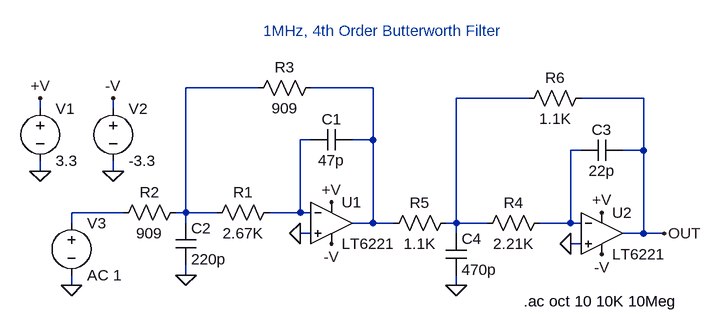
[diagram p0: schematic 6221.asc]
6221.asc, the LTspice schematic file:
Version 4
SHEET 1 1004 692
WIRE 144 48 32 48
WIRE 320 48 224 48
WIRE 560 64 448 64
WIRE 736 64 640 64
WIRE -192 80 -192 64
WIRE -80 80 -80 64
WIRE 224 128 208 128
WIRE 320 128 320 48
WIRE 320 128 288 128
WIRE 640 144 624 144
WIRE 736 144 736 64
WIRE 736 144 704 144
WIRE -192 176 -192 160
WIRE -80 176 -80 160
WIRE -64 240 -144 240
WIRE 32 240 32 48
WIRE 32 240 16 240
WIRE 80 240 32 240
WIRE 208 240 208 128
WIRE 208 240 160 240
WIRE 224 240 208 240
WIRE -144 256 -144 240
WIRE 32 256 32 240
WIRE 320 256 320 128
WIRE 320 256 288 256
WIRE 352 256 320 256
WIRE 448 256 448 64
WIRE 448 256 432 256
WIRE 496 256 448 256
WIRE 624 256 624 144
WIRE 624 256 576 256
WIRE 640 256 624 256
WIRE 224 272 208 272
WIRE 448 272 448 256
WIRE 736 272 736 144
WIRE 736 272 704 272
WIRE 768 272 736 272
WIRE 640 288 624 288
WIRE 32 336 32 320
WIRE -144 352 -144 336
WIRE 448 352 448 336
FLAG -192 176 0
FLAG 768 272 OUT
FLAG 256 224 +V
FLAG 256 288 -V
FLAG -192 64 +V
FLAG -80 176 0
FLAG -80 64 -V
FLAG 208 272 0
FLAG 32 336 0
FLAG -144 352 0
FLAG 672 240 +V
FLAG 672 304 -V
FLAG 624 288 0
FLAG 448 352 0
SYMBOL voltage -192 64 R0
WINDOW 123 44 91 Left 2
WINDOW 39 0 0 Left 2
SYMATTR InstName V1
SYMATTR Value 3.3
SYMBOL voltage -80 64 R0
WINDOW 123 44 91 Left 2
WINDOW 39 0 0 Left 2
SYMATTR InstName V2
SYMATTR Value -3.3
SYMBOL cap 288 112 R90
WINDOW 0 0 32 VBottom 2
WINDOW 3 32 32 VTop 2
SYMATTR InstName C1
SYMATTR Value 47p
SYMBOL res 176 224 R90
WINDOW 0 0 56 VBottom 2
WINDOW 3 32 56 VTop 2
SYMATTR InstName R1
SYMATTR Value 2.67K
SYMBOL res 32 224 R90
WINDOW 0 0 56 VBottom 2
WINDOW 3 32 56 VTop 2
SYMATTR InstName R2
SYMATTR Value 909
SYMBOL res 240 32 R90
WINDOW 0 0 56 VBottom 2
WINDOW 3 32 56 VTop 2
SYMATTR InstName R3
SYMATTR Value 909
SYMBOL cap 16 256 R0
SYMATTR InstName C2
SYMATTR Value 220p
SYMBOL voltage -144 240 R0
WINDOW 123 44 91 Left 2
WINDOW 39 0 0 Left 2
SYMATTR InstName V3
SYMATTR Value AC 1
SYMBOL cap 704 128 R90
WINDOW 0 0 32 VBottom 2
WINDOW 3 32 32 VTop 2
SYMATTR InstName C3
SYMATTR Value 22p
SYMBOL res 592 240 R90
WINDOW 0 0 56 VBottom 2
WINDOW 3 32 56 VTop 2
SYMATTR InstName R4
SYMATTR Value 2.21K
SYMBOL res 448 240 R90
WINDOW 0 0 56 VBottom 2
WINDOW 3 32 56 VTop 2
SYMATTR InstName R5
SYMATTR Value 1.1K
SYMBOL res 656 48 R90
WINDOW 0 0 56 VBottom 2
WINDOW 3 32 56 VTop 2
SYMATTR InstName R6
SYMATTR Value 1.1K
SYMBOL cap 432 272 R0
SYMATTR InstName C4
SYMATTR Value 470p
SYMBOL opamps\\LT6221 256 256 R0
SYMATTR InstName U1
SYMBOL opamps\\LT6221 672 272 R0
SYMATTR InstName U2
TEXT 552 376 Left 2 !.ac oct 10 10K 10Meg
TEXT 336 -24 Bottom 2 ;1MHz, 4th Order Butterworth Filter

The netlist it stands for:
* 6221.asc
V1 +V 0 3.3
V2 -V 0 -3.3
C1 N002 N004 47p
R1 N004 N001 2.67K
R2 N001 N006 909
R3 N002 N001 909
C2 N001 0 220p
V3 N006 0 AC 1
C3 OUT N005 22p
R4 N005 N003 2.21K
R5 N003 N002 1.1K
R6 OUT N003 1.1K
C4 N003 0 470p
* U1: LT6221 (symbol opamps\LT6221 not available, pins judged from their places): In+=0 In-=N004 V+=+V V-=-V OUT=N002
* U2: LT6221 (symbol opamps\LT6221 not available, pins judged from their places): In+=0 In-=N005 V+=+V V-=-V OUT=OUT
.ac oct 10 10K 10Meg
* 1MHz, 4th Order Butterworth Filter
.backanno
.end